# Altium project STM32P100.PrjPCB
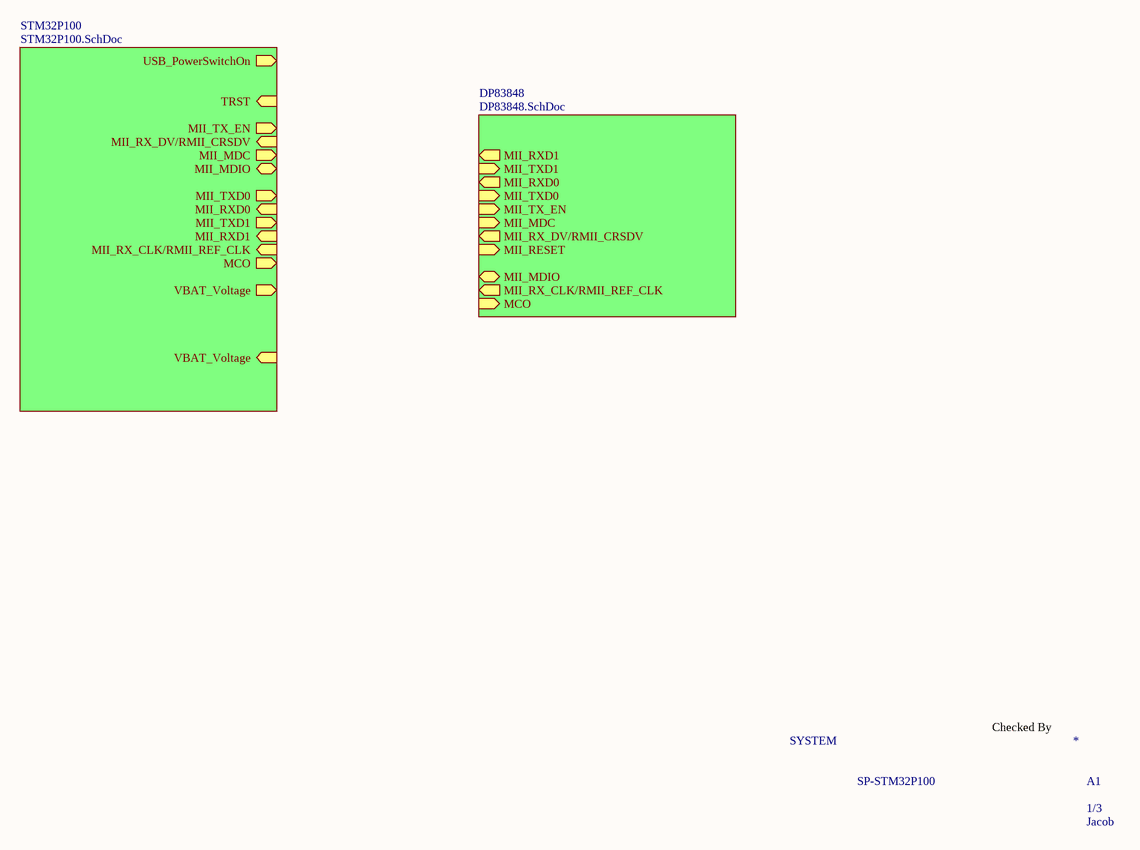
[diagram p0: System.SchDoc]
3 sheets, 85 parts. Net scope: hierarchical (ports join the sheet entries above them; power ports are global).
Board file: STM32P100.PcbDoc
Sheets:
  System.SchDoc
    STM32P100 = STM32P100.SchDoc
    DP83848 = DP83848.SchDoc

## Sheet System.SchDoc
size A4

### Sub-sheets
DP83848 = DP83848.SchDoc: MII_RXD1 (out), MII_TXD1 (in), MII_RXD0 (out), MII_TXD0 (in), MII_TX_EN (in), MII_MDC (in), MII_RX_DV/RMII_CRSDV (out), MII_RESET (in), MII_MDIO (bidir), MII_RX_CLK/RMII_REF_CLK (out), MCO (in)
STM32P100 = STM32P100.SchDoc: USB_PowerSwitchOn (out), MII_TX_EN (out), MII_RX_DV/RMII_CRSDV (in), MII_MDC (out), MII_MDIO (bidir), TRST (in), MII_TXD0 (out), MII_RXD0 (in), MII_TXD1 (out), MII_RXD1 (in), MII_RX_CLK/RMII_REF_CLK (in), MCO (out), VBAT_Voltage (out), VBAT_Voltage (in)

### Nets
NetJP8_2: sheet STM32P100/VBAT_Voltage, sheet STM32P100/VBAT_Voltage

### Notes on the sheet
- SYSTEM
- Checked By
- *
- SP-STM32P100
- A1
- 1/3
- Jacob

## Sheet STM32P100.SchDoc
size A3
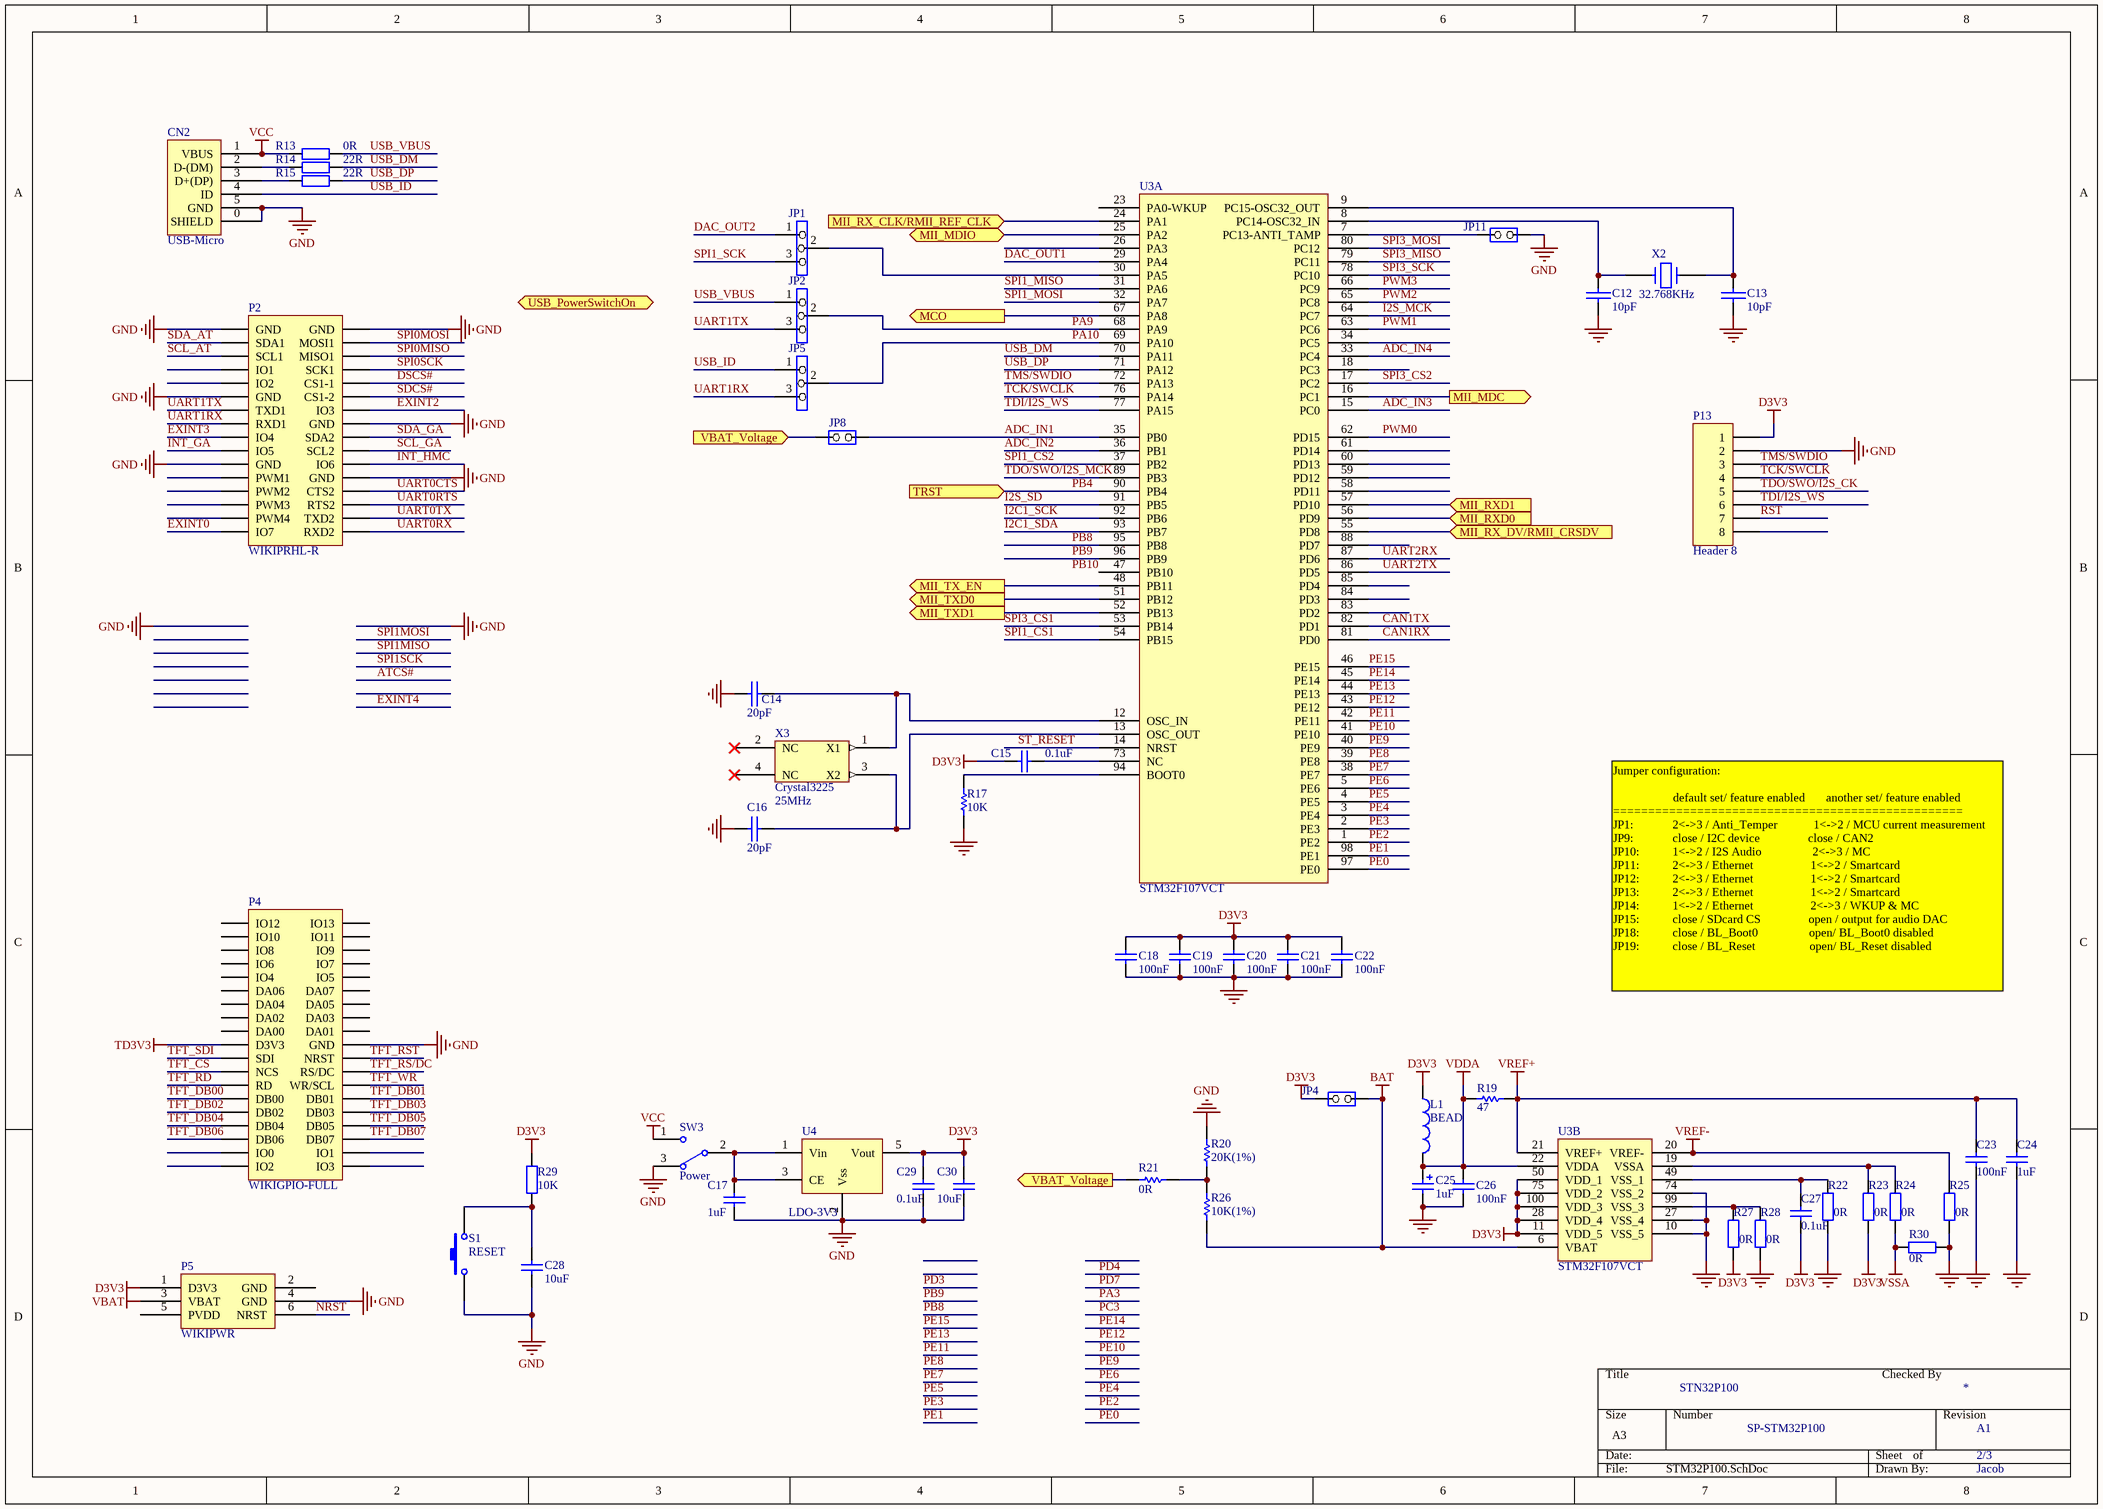
[diagram p1: STM32P100.SchDoc]

### Parts
C12  10pF  [0603M]
C13  10pF  [0603M]
C14  20pF  [0603M]
C15  0.1uF  [0603M]
C16  20pF  [0603M]
C17  1uF  [0805M]
C18  100nF  [0603M]
C19  100nF  [0603M]
C20  100nF  [0603M]
C21  100nF  [0603M]
C22  100nF  [0603M]
C23  100nF  [0603M]
C24  1uF  [0603M]
C25  1uF  [TAN-A]
C26  100nF  [0603M]
C27  0.1uF  [0603M]
C28  10uF  [0603L]
C29  0.1uF  [0603M]
C30  10uF  [0805M]
CN2  USB-Micro  [USB-MICRO-Female]
JP1  (no value)  [HDR1X3/2.00MM]
JP2  (no value)  [HDR1X3/2.00MM]
JP4  (no value)  [HDR1X2/2.00MM]
JP5  (no value)  [HDR1X3/2.00MM]
JP8  (no value)  [HDR1X2/2.00MM]
JP11  (no value)  [HDR1X2/2.00MM]
L1  BEAD  [0603L]
P2  WIKIPRHL-R  [WIKIPRHL-R]
P4  WIKIGPIO-FULL  [WIKIGPIO-FULL]
P5  WIKIPWR  [WIKIPWR]
P13  Header 8  [HDR1X8/2.54MM]
R13  0R  [0603M]
R14  22R  [0603M]
R15  22R  [0603M]
R17  10K  [0603M]
R19  47  [0603M]
R20  20K(1%)  [0603M]
R21  0R  [0603M]
R22  0R  [0603M]
R23  0R  [0603M]
R24  0R  [0603M]
R25  0R  [0603M]
R26  10K(1%)  [0603M]
R27  0R  [0603M]
R28  0R  [0603M]
R29  10K  [0603L]
R30  0R  [0603M]
S1  RESET  [KEY 6.1*4.0mm]
SW3  Power  [HDR1X3/2.54MM]
U3  STM32F107VCT  [LQFP100_N]  (parts A,B of 2)
U4  LDO-3V3  [SOT23-5]
X2  32.768KHz  [XTAL_32]
X3  Crystal3225  value 25MHz  [osc3225]

### Ports
MCO (out), MII_MDC (out), MII_MDIO (bidir), MII_RX_CLK/RMII_REF_CLK (in), MII_RX_DV/RMII_CRSDV (in), MII_RXD0 (in), MII_RXD1 (in), MII_TX_EN (out), MII_TXD0 (out), MII_TXD1 (out), TRST (in), USB_PowerSwitchOn (out), VBAT_Voltage (in), VBAT_Voltage (out)

### Nets
BAT: JP4.1(COMMON) R26.2 U3.6(VBAT)
D3V3: C15.1 C18.1 C19.1 C20.1 C21.1 C22.1 C27.1 C29.1 C30.1 JP4.2(NO) L1.1 P5.1(D3V3) P13.1 R23.2 R27.2 R29.2 U3.11(VDD_5) U3.28(VDD_4) U3.50(VDD_1) U3.75(VDD_2) U3.100(VDD_3) U4.5(Vout)
GND: C12.2 C13.2 C14.2 C16.2 C17.2 C18.2 C19.2 C20.2 C21.2 C22.2 C23.2 C24.2 C25.2 C26.2 C28.1 C29.2 C30.2 CN2.0(SHIELD) CN2.5(GND) JP11.1(COMMON) P2.1(GND) P2.2(GND) P2.11(GND) P2.16(GND) P2.21(GND) P2.24(GND) P4.20(GND) P5.4(GND) P13.2 R17.2 R20.1 R22.2 R25.2 R28.2 R30.1 S1.1 SW3.3 U3.10(VSS_5) U3.27(VSS_4) U3.74(VSS_2) U4.2(Vss)
TD3V3: P4.19(D3V3)
VBAT: P5.3(VBAT)
VCC: CN2.1(VBUS) R13.1 SW3.1
VDDA: C25.1 C26.1 L1.2 R19.2 U3.22(VDDA)
VREF+: C23.1 C24.1 R19.1 U3.21(VREF+)
VREF-: R25.1 U3.20(VREF-)
VSSA: R24.2 R30.2
ADC_IN1: JP8.1(COMMON) U3.35(PB0)
ADC_IN2: U3.36(PB1)
ADC_IN3: U3.15(PC0)
ADC_IN4: U3.33(PC4)
CAN1RX: U3.81(PD0)
CAN1TX: U3.82(PD1)
DAC_OUT1: U3.29(PA4)
DAC_OUT2: JP1.1
DSCS#: P2.10(CS1-1)
EXINT0: P2.31(IO7)
EXINT2: P2.14(IO3)
EXINT3: P2.17(IO4)
I2C1_SCK: U3.92(PB6)
I2C1_SDA: U3.93(PB7)
I2S_MCK: U3.64(PC7)
I2S_SD: U3.91(PB5)
INT_GA: P2.19(IO5)
INT_HMC: P2.22(IO6)
NRST: P5.6(NRST)
PA9: JP2.2 U3.68(PA9)
PA10: JP5.2 U3.69(PA10)
PB4: U3.90(PB4) ; port TRST
PB8: U3.95(PB8)
PB9: U3.96(PB9)
PE0: U3.97(PE0)
PE1: U3.98(PE1)
PE2: U3.1(PE2)
PE3: U3.2(PE3)
PE4: U3.3(PE4)
PE5: U3.4(PE5)
PE6: U3.5(PE6)
PE7: U3.38(PE7)
PE8: U3.39(PE8)
PE9: U3.40(PE9)
PE10: U3.41(PE10)
PE11: U3.42(PE11)
PE12: U3.43(PE12)
PE13: U3.44(PE13)
PE14: U3.45(PE14)
PE15: U3.46(PE15)
PWM0: U3.62(PD15)
PWM1: U3.63(PC6)
PWM2: U3.65(PC8)
PWM3: U3.66(PC9)
RST: P13.7
SCL_AT: P2.5(SCL1)
SCL_GA: P2.20(SCL2)
SDA_AT: P2.3(SDA1)
SDA_GA: P2.18(SDA2)
SDCS#: P2.12(CS1-2)
SPI0MISO: P2.6(MISO1)
SPI0MOSI: P2.4(MOSI1)
SPI0SCK: P2.8(SCK1)
SPI1_CS1: U3.54(PB15)
SPI1_CS2: U3.37(PB2)
SPI1_MISO: U3.31(PA6)
SPI1_MOSI: U3.32(PA7)
SPI1_SCK: JP1.3
SPI3_CS1: U3.53(PB14)
SPI3_CS2: U3.17(PC2)
SPI3_MISO: U3.79(PC11)
SPI3_MOSI: U3.80(PC12)
SPI3_SCK: U3.78(PC10)
ST_RESET: U3.14(NRST)
TCK/SWCLK: P13.4 U3.76(PA14)
TDI/I2S_WS: P13.6 U3.77(PA15)
TDO/SWO/I2S_CK: P13.5
TDO/SWO/I2S_MCK: U3.89(PB3)
TFT_CS: P4.23(NCS)
TFT_DB00: P4.27(DB00)
TFT_DB01: P4.28(DB01)
TFT_DB02: P4.29(DB02)
TFT_DB03: P4.30(DB03)
TFT_DB04: P4.31(DB04)
TFT_DB05: P4.32(DB05)
TFT_DB06: P4.33(DB06)
TFT_DB07: P4.34(DB07)
TFT_RD: P4.25(RD)
TFT_RS/DC: P4.24(RS/DC)
TFT_RST: P4.22(NRST)
TFT_SDI: P4.21(SDI)
TFT_WR: P4.26(WR/SCL)
TMS/SWDIO: P13.3 U3.72(PA13)
UART0CTS: P2.26(CTS2)
UART0RTS: P2.28(RTS2)
UART0RX: P2.32(RXD2)
UART0TX: P2.30(TXD2)
UART1RX: JP5.3 P2.15(RXD1)
UART1TX: JP2.3 P2.13(TXD1)
UART2RX: U3.87(PD6)
UART2TX: U3.86(PD5)
USB_DM: R14.2 U3.70(PA11)
USB_DP: R15.2 U3.71(PA12)
USB_ID: CN2.4(ID) JP5.1
USB_VBUS: JP2.1 R13.2
NetC12_1: C12.1 U3.8(PC14-OSC32_IN) X2.2
NetC13_1: C13.1 U3.9(PC15-OSC32_OUT) X2.1
NetC14_1: C14.1 U3.12(OSC_IN) X3.1(X1)
NetC15_2: C15.2 U3.73(NC)
NetC16_1: C16.1 U3.13(OSC_OUT) X3.3(X2)
NetC17_1: C17.1 SW3.2 U4.1(Vin) U4.3(CE)
NetC27_2: C27.2 R22.1 U3.49(VSS_1)
NetC28_2: C28.2 R29.1 S1.2
NetCN2_2: CN2.2(D-(DM)) R14.1
NetCN2_3: CN2.3(D+(DP)) R15.1
NetJP1_2: JP1.2 U3.30(PA5)
NetJP8_2: JP8.2(NO) R21.1 ; port VBAT_Voltage
NetJP11_2: JP11.2(NO) U3.7(PC13-ANTI_TAMP)
NetR17_1: R17.1 U3.94(BOOT0)
NetR20_2: R20.2 R21.2 R26.1
NetR23_1: R23.1 R24.1 U3.19(VSSA)
NetR27_1: R27.1 R28.1 U3.99(VSS_3)
NetU3_16: U3.16(PC1) ; port MII_MDC
NetU3_24: U3.24(PA1) ; port MII_RX_CLK/RMII_REF_CLK
NetU3_25: U3.25(PA2) ; port MII_MDIO
NetU3_48: U3.48(PB11) ; port MII_TX_EN
NetU3_51: U3.51(PB12) ; port MII_TXD0
NetU3_52: U3.52(PB13) ; port MII_TXD1
NetU3_55: U3.55(PD8) ; port MII_RX_DV/RMII_CRSDV
NetU3_56: U3.56(PD9) ; port MII_RXD0
NetU3_57: U3.57(PD10) ; port MII_RXD1
NetU3_67: U3.67(PA8) ; port MCO

Not connected (* = marked no-connect by the designer): P2 7(IO1) 9(IO2) 23(PWM1) 25(PWM2) 27(PWM3) 29(PWM4); P4 1(IO12) 2(IO13) 3(IO10) 4(IO11) 5(IO8) 6(IO9) 7(IO6) 8(IO7) 9(IO4) 10(IO5) 11(DA06) 12(DA07) 13(DA04) 14(DA05) 15(DA02) 16(DA03) 17(DA00) 18(DA01) 35(IO0) 36(IO1) 37(IO2) 38(IO3); P5 2(GND) 5(PVDD); P13 8; U3 18(PC3) 23(PA0-WKUP) 26(PA3) 34(PC5) 47(PB10) 58(PD11) 59(PD12) 60(PD13) 61(PD14) 83(PD2) 84(PD3) 85(PD4) 88(PD7); U4 4(NC); X3 2(NC)* 4(NC)*

### Notes on the sheet
- Jumper configuration:
  default set/ feature enabled       another set/ feature enabled
  ==================================================
  JP1:             2<->3 / Anti_Temper            1<->2 / MCU current measurement
  JP9:             close / I2C device                close / CAN2
  JP10:           1<->2 / I2S Audio                 2<->3 / MC
  JP11:           2<->3 / Ethernet                   1<->2 / Smartcard
  JP12:           2<->3 / Ethernet                   1<->2 / Smartcard
  JP13:           2<->3 / Ethernet                   1<->2 / Smartcard
  JP14:           1<->2 / Ethernet                   2<->3 / WKUP & MC
  JP15:           close / SDcard CS                open / output for audio DAC
  JP18:           close / BL_Boot0                 open/ BL_Boot0 disabled
  JP19:           close / BL_Reset                  open/ BL_Reset disabled
- STN32P100
- Checked By
- *
- SP-STM32P100
- A1
- 2/3
- Jacob
- Labels drawn without touching a wire or pin: PB10

### Library data of the parts
C12-C14 C16 = CAP: Capacitor
C15 C17 C27-C30 = Cap: Capacitor; Published: 8-Jun-2000; LatestRevisionDate: 17-Jul-2002; LatestRevisionNote: Re-released for DXP Platform.; PackageReference: RAD-0.3
  C15 C27: Value: 0.1uF
  C17: Publisher: Altium Limited; Value: 1uF
  C28 C30: Publisher: Altium Limited; Value: 10uF
  C29: Publisher: Altium Limited; Value: 0.1uF
C18-C24 C26 = Cap: Capacitor; Value: 10nF; Published: 8-Jun-2000; Revision: July-2002: Re-released for DXP Platform.; Publisher: Altium Limited
C25 = Cap Pol1: Polarized Capacitor (Radial); Value: 10uF; Published: 8-Jun-2000; Revision: July-2002: Re-released for DXP Platform.; Publisher: Altium Limited
JP1 JP2 JP5 = Jumper3
JP4 JP8 JP11 = JP2
L1 = Inductor: Value: 100uH; Published: 8-Jun-2000; Revision: July-2002: Re-released for DXP Platform.; Publisher: Altium Limited
P2 = WIKIPRHL-R: Header, 16-Pin, Dual row; LatestRevisionDate: 17-Jul-2002; LatestRevisionNote: Re-released for DXP Platform.; Publisher: Altium Limited
P4 = WIKIGPIO-FULL: Header, 19-Pin, Dual row; LatestRevisionDate: 17-Jul-2002; LatestRevisionNote: Re-released for DXP Platform.; Publisher: Altium Limited
P5 = WIKIPWR: PWR HDR
P13 = Header 8: Header, 8-Pin; LatestRevisionDate: 17-Jul-2002; LatestRevisionNote: Re-released for DXP Platform.; Publisher: Altium Limited
R13-R15 R22-R25 R27-R30 = Res2: Resistor; Published: 8-Jun-2000; LatestRevisionDate: 17-Jul-2002; LatestRevisionNote: Re-released for DXP Platform.; PackageReference: AXIAL-0.4; Publisher: Altium Limited
  R13 R22-R25 R27 R28 R30: Value: 0R
  R14 R15: Value: 22R
  R29: Value: 10K
R17 R20 R21 R26 = res1: Resistor; Value: 1K; Published: 8-Jun-2000; Revision: July-2002: Re-released for DXP Platform.; Publisher: Altium Limited
R19 = Res1: Resistor; Value: 1K; Published: 8-Jun-2000; Revision: July-2002: Re-released for DXP Platform.; Publisher: Altium Limited
S1 = SW-PB: Switch; Published: 24-Mar-1999; LatestRevisionDate: 17-Jul-2002; LatestRevisionNote: Re-released for DXP Platform.; PackageReference: SPST-2; Publisher: Altium Limited
SW3 = SW-SPDT: SPDT Subminiature Toggle Switch, Right Angle Mounting, Vertical Actuation; Revision 1: Jul-2002: Re-released for DXP Platform.; Revision 2: 17-Dec-2003: Schematic revised, PCB Footprint replaced.; Published: 24-Mar-1999; Datasheet: Latest Revision: 05-Dec-2000; Publisher: Altium Limited
U3 = BARRACUDA_256K
U4 = XC6219: LDO
X2 = CRYSTAL
X3 = Crystal322

## Sheet DP83848.SchDoc
size A4
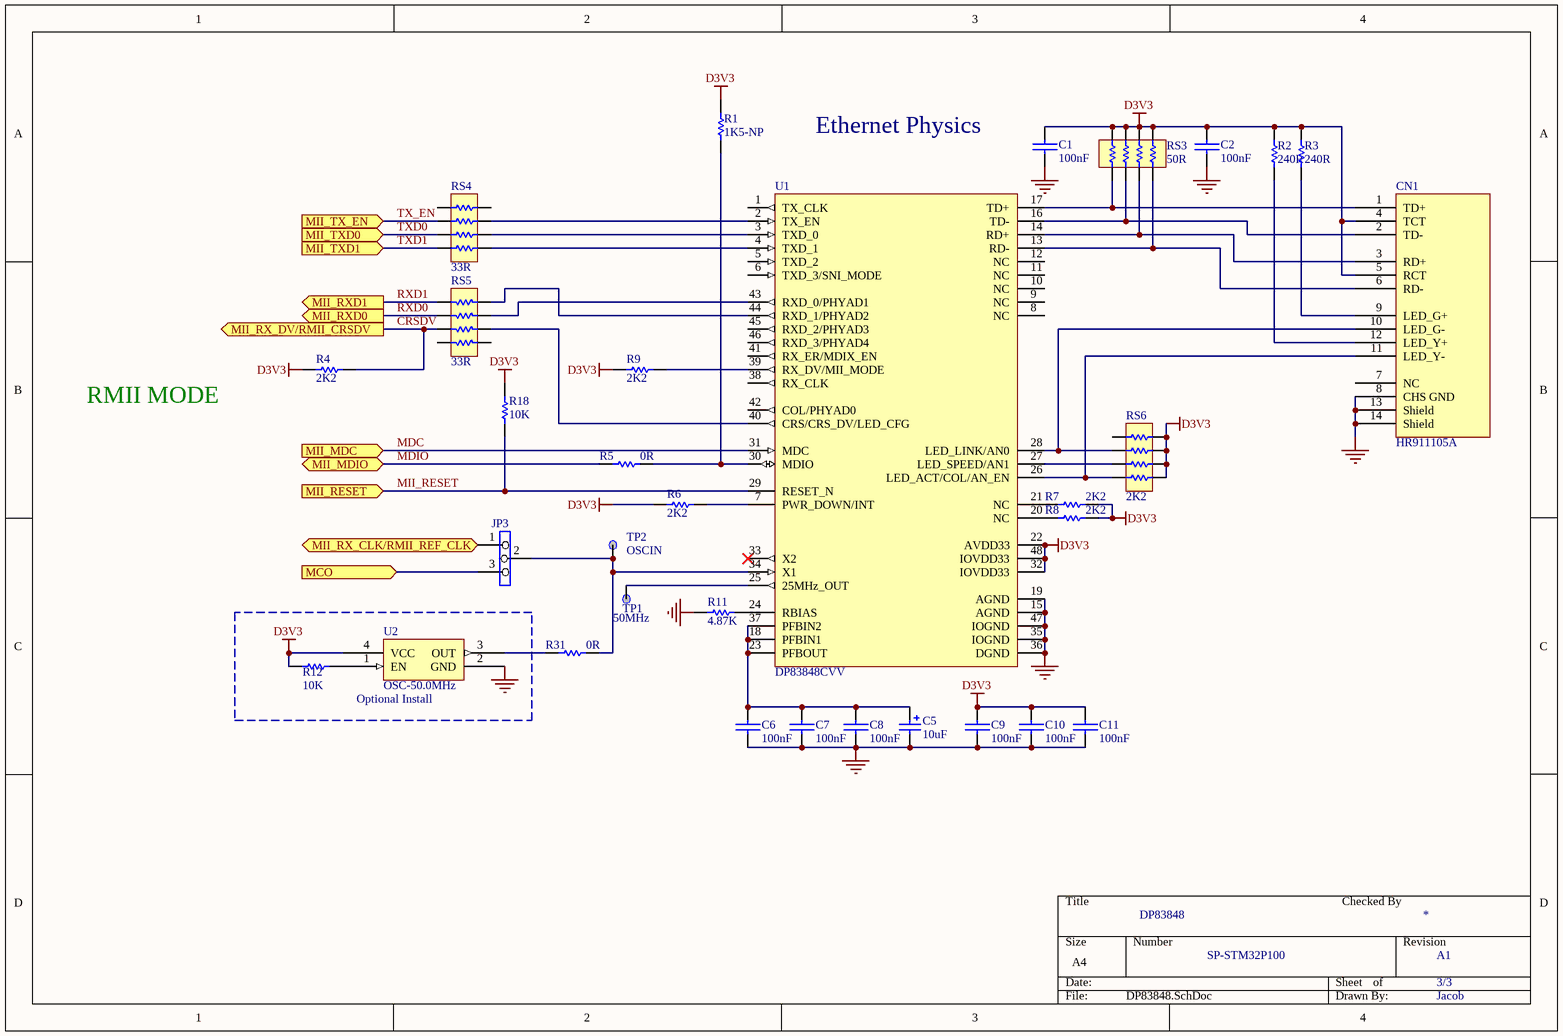
[diagram p2: DP83848.SchDoc]

### Parts
C1  100nF  [0603M]
C2  100nF  [0603M]
C5  10uF  [TAN-A]
C6  100nF  [0603M]
C7  100nF  [0603M]
C8  100nF  [0603M]
C9  100nF  [0603M]
C10  100nF  [0603M]
C11  100nF  [0603M]
CN1  HR911105A  [HR911105A]
JP3  (no value)  [HDR1X3/2.00MM]
R1  1K5-NP  [0603M]
R2  240R  [0603M]
R3  240R  [0603M]
R4  2K2  [0603M]
R5  0R  [0603M]
R6  2K2  [0603M]
R7  2K2  [0603M]
R8  2K2  [0603M]
R9  2K2  [0603M]
R11  4.87K  [0603M]
R12  10K  [0603M]
R18  10K  [0603M]
R31  0R  [0603M]
RS3  50R  [RES-4B]
RS4  33R  [RES-4B]
RS5  33R  [RES-4B]
RS6  2K2  [RES-4B]
TP1  50MHz  [TP HOLE]
TP2  OSCIN  [TP]
U1  DP83848CVV  [LQFP48]
U2  OSC-50.0MHz  [XTAL_5X7]

### Blocks framed on the sheet
Optional Install: R12 U2

### Ports
MCO (in), MII_MDC (in), MII_MDIO (bidir), MII_RESET (in), MII_RX_CLK/RMII_REF_CLK (out), MII_RX_DV/RMII_CRSDV (out), MII_RXD0 (out), MII_RXD1 (out), MII_TX_EN (in), MII_TXD0 (in), MII_TXD1 (in)

### Nets
D3V3: C1.2 C2.2 C9.1 C10.2 C11.2 CN1.4(TCT) CN1.5(RCT) R1.2 R2.2 R3.2 R4.2 R6.1 R7.2 R8.2 R9.2 R12.1 R18.2 RS3.1 RS3.3 RS3.5 RS3.7 RS6.1 RS6.3 RS6.5 RS6.7 U1.22(AVDD33) U1.32(IOVDD33) U1.48(IOVDD33) U2.4(VCC)
GND: C1.1 C2.1 C5.2 C6.2 C7.1 C8.1 C9.2 C10.1 C11.1 CN1.8(CHS_GND) CN1.13(Shield) CN1.14(Shield) R11.1 U1.15(AGND) U1.19(AGND) U1.35(IOGND) U1.36(DGND) U1.47(IOGND) U2.2(GND)
CRSDV: R4.1 RS5.6 ; port MII_RX_DV/RMII_CRSDV
MDC: U1.31(MDC) ; port MII_MDC
MDIO: R5.1 ; port MII_MDIO
MII_RESET: R18.1 U1.29(RESET_N) ; port MII_RESET
RXD0: RS5.4 ; port MII_RXD0
RXD1: RS5.2 ; port MII_RXD1
TX_EN: RS4.6 ; port MII_TX_EN
TXD0: RS4.4 ; port MII_TXD0
TXD1: RS4.2 ; port MII_TXD1
NetC5_1: C5.1 C6.1 C7.2 C8.2 U1.18(PFBIN1) U1.23(PFBOUT) U1.37(PFBIN2)
NetCN1_1: CN1.1(TD+) RS3.8 U1.17(TD+)
NetCN1_2: CN1.2(TD-) RS3.6 U1.16(TD-)
NetCN1_3: CN1.3(RD+) RS3.4 U1.14(RD+)
NetCN1_6: CN1.6(RD-) RS3.2 U1.13(RD-)
NetCN1_9: CN1.9(LED_G+) R3.1
NetCN1_10: CN1.10(LED_G-) RS6.6 U1.28(LED_LINK/AN0)
NetCN1_11: CN1.11(LED_Y-) RS6.2 U1.26(LED_ACT/COL/AN_EN)
NetCN1_12: CN1.12(LED_Y+) R2.1
NetJP3_1: JP3.1 ; port MII_RX_CLK/RMII_REF_CLK
NetJP3_2: JP3.2 R31.2 TP2.1 U1.34(X1)
NetJP3_3: JP3.3 ; port MCO
NetR1_1: R1.1 R5.2 U1.30(MDIO)
NetR6_2: R6.2 U1.7(PWR_DOWN/INT)
NetR7_1: R7.1 U1.21(NC)
NetR8_1: R8.1 U1.20(NC)
NetR9_1: R9.1 U1.39(RX_DV/MII_MODE)
NetR11_2: R11.2 U1.24(RBIAS)
NetR12_2: R12.2 U2.1(EN)
NetR31_1: R31.1 U2.3(OUT)
NetRS4_1: RS4.1 U1.4(TXD_1)
NetRS4_3: RS4.3 U1.3(TXD_0)
NetRS4_5: RS4.5 U1.2(TX_EN)
NetRS5_1: RS5.1 U1.44(RXD_1/PHYAD2)
NetRS5_3: RS5.3 U1.43(RXD_0/PHYAD1)
NetRS5_5: RS5.5 U1.40(CRS/CRS_DV/LED_CFG)
NetRS6_4: RS6.4 U1.27(LED_SPEED/AN1)
NetTP1_1: TP1.1 U1.25(25MHz_OUT)

Not connected (* = marked no-connect by the designer): CN1 7(NC); RS4 7 8; RS5 7 8; RS6 8; U1 1(TX_CLK) 5(TXD_2) 6(TXD_3/SNI_MODE) 8(NC) 9(NC) 10(NC) 11(NC) 12(NC) 33(X2)* 38(RX_CLK) 41(RX_ER/MDIX_EN) 42(COL/PHYAD0) 45(RXD_2/PHYAD3) 46(RXD_3/PHYAD4)

### Notes on the sheet
- (near C1) Ethernet Physics
- RMII MODE
- DP83848
- Checked By
- *
- SP-STM32P100
- A1
- 3/3
- Jacob

### Library data of the parts
C1 C2 C6-C11 = CAP: Capacitor
C5 = Cap Pol1: Polarized Capacitor (Radial); Published: 8-Jun-2000; Revision: July-2002: Re-released for DXP Platform.; Publisher: Altium Limited; Value: 10uF
CN1 = HR911105A: RJ45 From Hanren
JP3 = Jumper3
R1-R9 R11 R12 R18 R31 = Res1: Resistor; Value: 1K; Published: 8-Jun-2000; Revision: July-2002: Re-released for DXP Platform.; Publisher: Altium Limited
RS3-RS6 = Resister Array
TP1 TP2 = TP
U2 = SM7745HEV-50.0M

## Nets that join several sheets
D3V3: STM32P100 (22 pins), DP83848 (29 pins)
GND: STM32P100 (41 pins), DP83848 (19 pins)